# Altium schematic sheet ASBB_BNO055.SchDoc
size A4
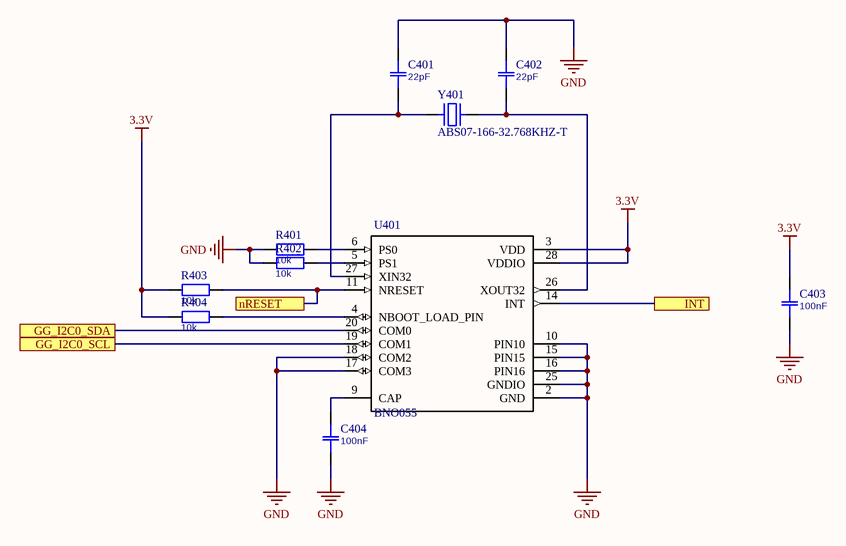
[diagram p0: ASBB_BNO055.SchDoc]

## Parts
C401  22pF  [0603]
C402  22pF  [0603]
C403  100nF  [0603]
C404  100nF  [0603]
R401  10k  [0603]
R402  10k  [0603]
R403  10k  [0603]
R404  10k  [0603]
U401  BNO055  [LGA28R50P4X10_380X520X100]
Y401  ABS07-166-32.768KHZ-T  [ABRACON ABS07]

## Ports
GG_I2C0_SCL, GG_I2C0_SDA, INT, nRESET

## Nets
3.3V: C403.2 R403.1 R404.1 U401.3(VDD) U401.28(VDDIO)
GND: C401.2 C402.2 C403.1 C404.1 R401.1 R402.1 U401.2(GND) U401.10(PIN10) U401.15(PIN15) U401.16(PIN16) U401.17(COM3) U401.18(COM2) U401.25(GNDIO)
GG_I2C0_SCL: U401.19(COM1) ; port GG_I2C0_SCL
GG_I2C0_SDA: U401.20(COM0) ; port GG_I2C0_SDA
INT: U401.14(INT) ; port INT
nRESET: R403.2 U401.11(NRESET) ; port nRESET
NetC401_1: C401.1 U401.27(XIN32) Y401.1
NetC402_1: C402.1 U401.26(XOUT32) Y401.2
NetC404_2: C404.2 U401.9(CAP)
NetR401_2: R401.2 U401.6(PS0)
NetR402_2: R402.2 U401.5(PS1)
NetR404_2: R404.2 U401.4(NBOOT_LOAD_PIN)

## Library data of the parts
C401-C404 = Capacitor: Partnumber: ?; Value: ?
R401-R404 = Resistor: Partnumber: ?; Value: ?
U401 = BNO055: BNO055 9-axis Absolute Orientation Sensor _ SiP _ w/Sensors and Sensor Fusion; MF: Bosch; MP: BNO055; SnapEDA_Link: https://www.snapeda.com/parts/BNO055/Bosch%20Sensortec/view-part/?ref=snap; Package: LGA-28 Bosch; Availability: Unavailable; Price: None; Value: *
Y401 = Abracon Crystal ABS06: SMT Crystal